# EAGLE design ASURA7200 (EAGLE 9.6.2)
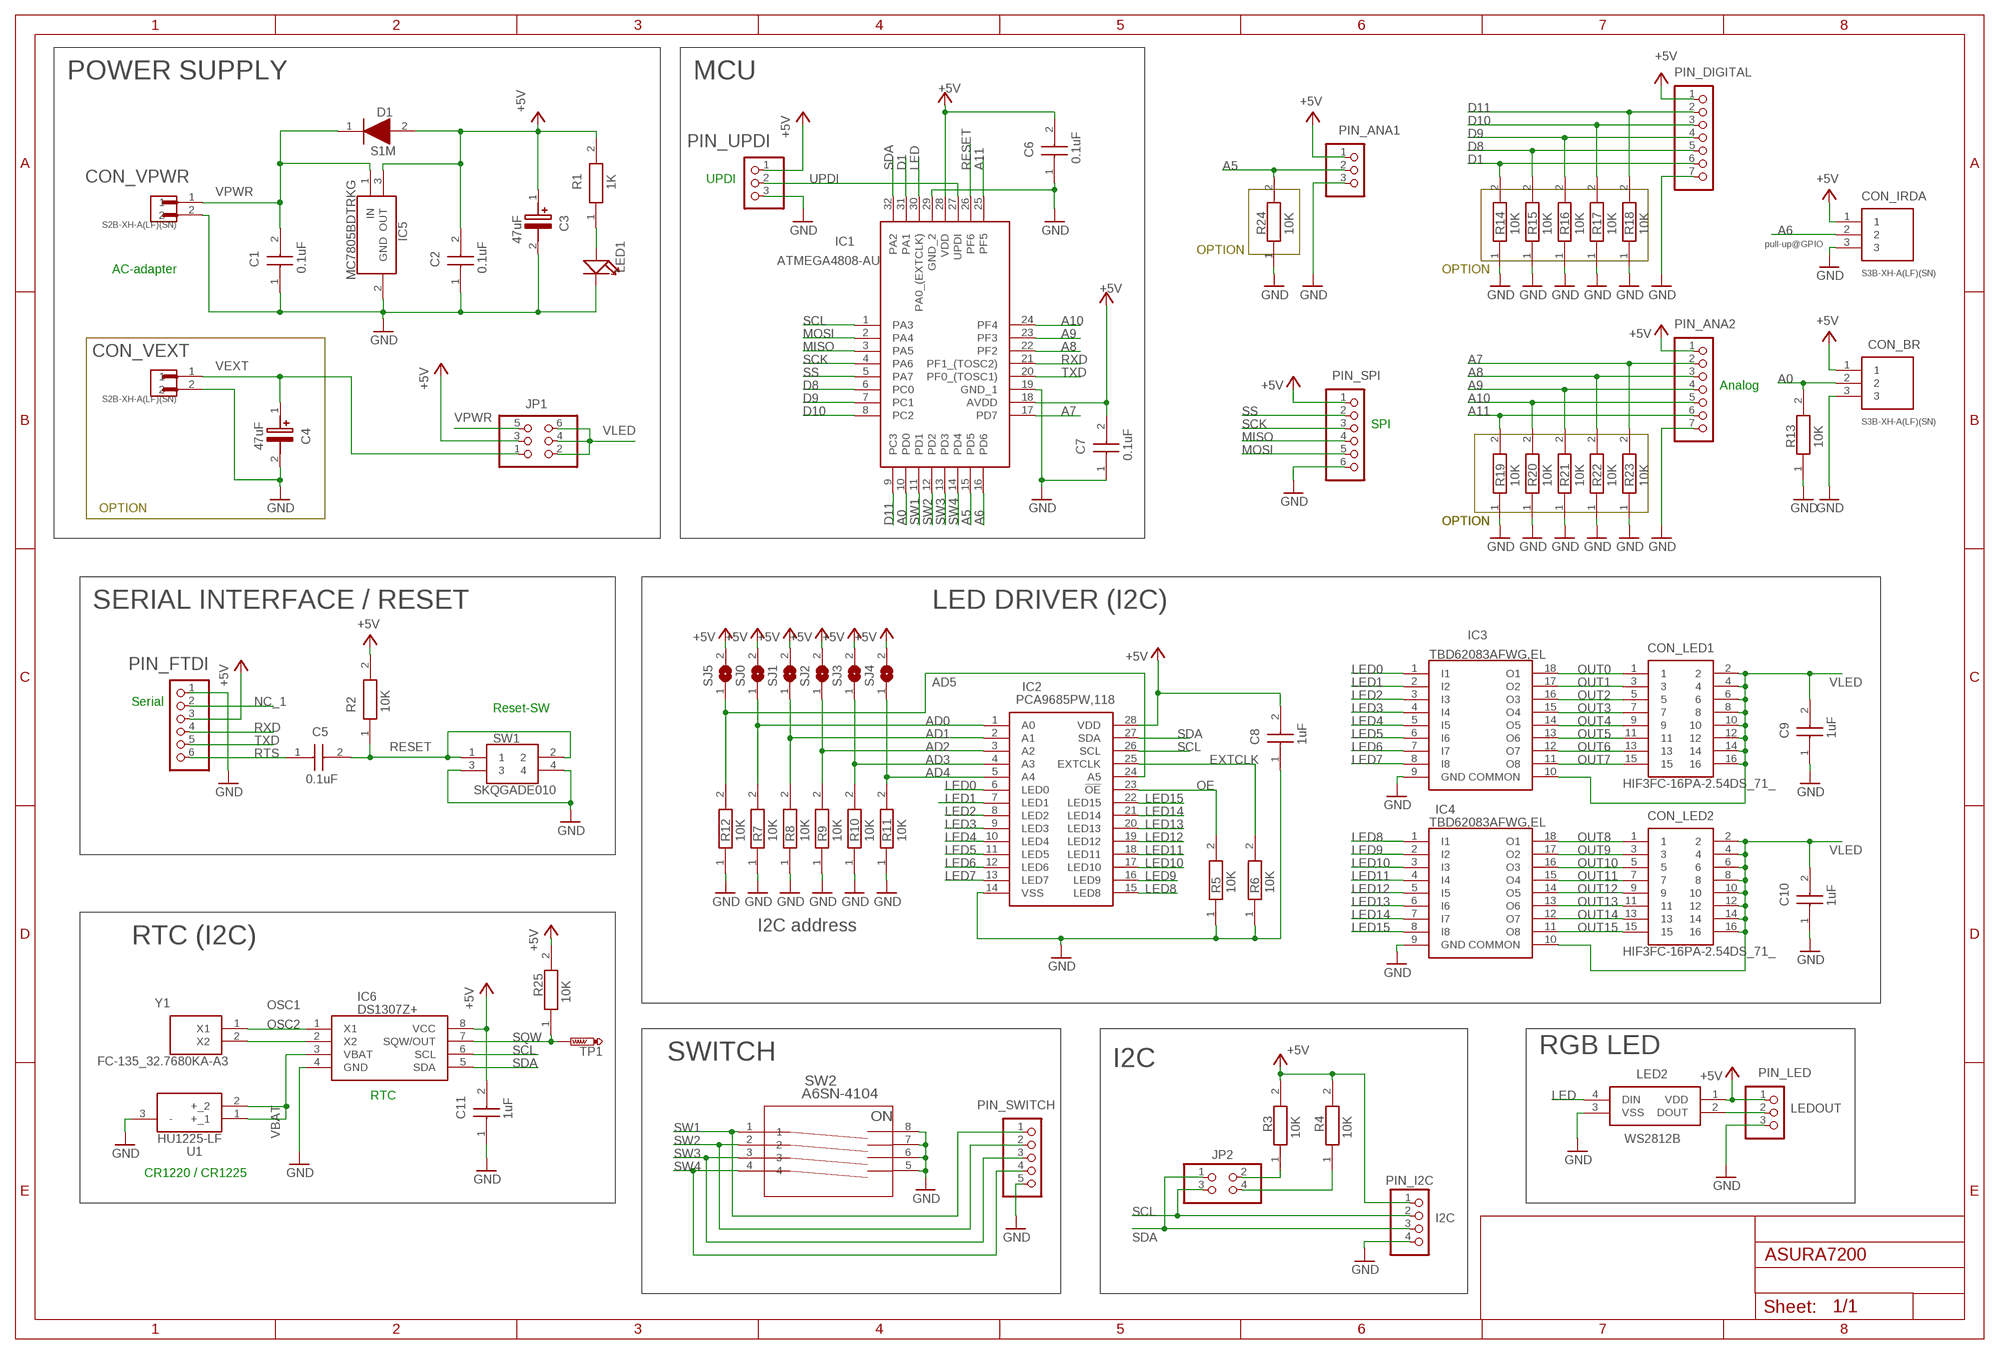
[diagram p0: schematic, sheet 1]

## Parts
C1  CC0603KRX7R9BB104  [CAPC1608X90N]
C2  CC0603KRX7R8BB105  [CAPC1608X90N]
C3  UUD1H470MCL1GS  [CAPAE660X800N]
C4  UUD1H470MCL1GS  [CAPAE660X800N]
C5  CC0603KRX7R8BB105  [CAPC1608X90N]
C6  CC0603KRX7R8BB105  [CAPC1608X90N]
C7  CC0603KRX7R8BB105  [CAPC1608X90N]
C8  CC0603KRX7R9BB104  [CAPC1608X90N]
C9  CC0603KRX7R9BB104  [CAPC1608X90N]
C10  CC0603KRX7R9BB104  [CAPC1608X90N]
C11  CC0603KRX7R8BB105  [CAPC1608X90N]
CON_BR  S3B-XH-A(LF)(SN)  [JST_S3B-XH-A(LF)(SN)]
CON_IRDA  S3B-XH-A(LF)(SN)  [JST_S3B-XH-A(LF)(SN)]
CON_LED1  HIF3FC-16PA-2.54DS_71_  [SHDRRA16W69P254X254_2X8_2782X8]
CON_LED2  HIF3FC-16PA-2.54DS_71_  [SHDRRA16W69P254X254_2X8_2782X8]
CON_VEXT  S2B-XH-A(LF)(SN)  [JST_S2B-XH-A(LF)(SN)]
CON_VPWR  S2B-XH-A(LF)(SN)  [JST_S2B-XH-A(LF)(SN)]
D1  S1M  [DIOM5227X270N]
IC1  ATMEGA4808-AU  [QFP80P900X900X120-32N]
IC2  PCA9685PW,118  [SOP65P640X110-28N]
IC3  TBD62083AFWG,EL  [SOIC127P1032X285-18N]
IC4  TBD62083AFWG,EL  [SOIC127P1032X285-18N]
IC5  MC7805BDTRKG  [LM317MADTRKG]
IC6  DS1307Z+  [SOIC127P600X175-8N]
JP1  PINHD-2X3  [2X03]
JP2  PINHD-2X2  [2X02]
LED1  SMD-LED-CLEAR-GREEN(0603)  [LED-0603]
LED2  WS2812B  [WS2812B]
PIN_ANA1  PINHD-1X3  [1X03]
PIN_ANA2  PINHD-1X7  [1X07]
PIN_DIGITAL  PINHD-1X7  [1X07]
PIN_FTDI  PINHD-1X6/90  [1X06/90]
PIN_I2C  PINHD-1X4  [1X04]
PIN_LED  PINHD-1X3  [1X03]
PIN_SPI  PINHD-1X6  [1X06]
PIN_SWITCH  PINHD-1X5  [1X05]
PIN_UPDI  PINHD-1X3  [1X03]
R1  RC0603JR-071KL  [RESC1608X55N]
R2  RC0603JR-0710KL  [RESC1608X55N]
R3  RC0603JR-0710KL  [RESC1608X55N]
R4  RC0603JR-0710KL  [RESC1608X55N]
R5  RC0603JR-0710KL  [RESC1608X55N]
R6  RC0603JR-0710KL  [RESC1608X55N]
R7  RC0603JR-0710KL  [RESC1608X55N]
R8  RC0603JR-0710KL  [RESC1608X55N]
R9  RC0603JR-0710KL  [RESC1608X55N]
R10  RC0603JR-0710KL  [RESC1608X55N]
R11  RC0603JR-0710KL  [RESC1608X55N]
R12  RC0603JR-0710KL  [RESC1608X55N]
R13  RC0603JR-0710KL  [RESC1608X55N]
R14  RC0603JR-0710KL  [RESC1608X55N]
R15  RC0603JR-0710KL  [RESC1608X55N]
R16  RC0603JR-0710KL  [RESC1608X55N]
R17  RC0603JR-0710KL  [RESC1608X55N]
R18  RC0603JR-0710KL  [RESC1608X55N]
R19  RC0603JR-0710KL  [RESC1608X55N]
R20  RC0603JR-0710KL  [RESC1608X55N]
R21  RC0603JR-0710KL  [RESC1608X55N]
R22  RC0603JR-0710KL  [RESC1608X55N]
R23  RC0603JR-0710KL  [RESC1608X55N]
R24  RC0603JR-0710KL  [RESC1608X55N]
R25  RC0603JR-0710KL  [RESC1608X55N]
SJ0  SJ  [SJ]
SJ1  SJ  [SJ]
SJ2  SJ  [SJ]
SJ3  SJ  [SJ]
SJ4  SJ  [SJ]
SJ5  SJ  [SJ]
SW1  SKQGADE010  [SKQGAKE010]
SW2  A6SN-4104  [SW_A6SN-4104_OMR]
TP1  PTR1PAD1-13  [P1-13]
U1  HU1225-LF  [HU1225LF]
Y1  FC-135_32.7680KA-A3  [FC135327680KAA3]

## Nets
+5V [Power]: C2.2 C3.1(+) C6.2 C7.2 C8.2 C11.2 CON_BR.1 CON_IRDA.1 D1.2(A) IC1.18(AVDD) IC1.28(VDD) IC2.28(VDD) IC5.3(OUT) IC6.8(VCC) JP1.3 LED2.1(VDD) PIN_ANA1.1 PIN_ANA2.1 PIN_DIGITAL.1 PIN_FTDI.3 PIN_I2C.1 PIN_LED.1 PIN_SPI.1 PIN_UPDI.1 R1.2 R2.2 R3.2 R4.2 R25.2 SJ0.2 SJ1.2 SJ2.2 SJ3.2 SJ4.2 SJ5.2
A0: CON_BR.2 IC1.10(PD0) R13.2
A5: IC1.15(PD5) PIN_ANA1.2 R24.2
A6: CON_IRDA.2 IC1.16(PD6)
A7: IC1.17(PD7) PIN_ANA2.2 R23.2
A8: IC1.22(PF2) PIN_ANA2.3 R22.2
A9: IC1.23(PF3) PIN_ANA2.4 R21.2
A10: IC1.24(PF4) PIN_ANA2.5 R20.2
A11: IC1.25(PF5) PIN_ANA2.6 R19.2
AD0: IC2.1(A0) R7.2 SJ0.1
AD1: IC2.2(A1) R8.2 SJ1.1
AD2: IC2.3(A2) R9.2 SJ2.1
AD3: IC2.4(A3) R10.2 SJ3.1
AD4: IC2.5(A4) R11.2 SJ4.1
AD5: IC2.24(A5) R12.2 SJ5.1
D1: IC1.31(PA1) PIN_DIGITAL.6 R14.2
D8: IC1.6(PC0) PIN_DIGITAL.5 R15.2
D9: IC1.7(PC1) PIN_DIGITAL.4 R16.2
D10: IC1.8(PC2) PIN_DIGITAL.3 R17.2
D11: IC1.9(PC3) PIN_DIGITAL.2 R18.2
EXTCLK: IC2.25(EXTCLK) R6.2
GND [Ground]: C1.1 C2.1 C3.2(-) C4.2(-) C6.1 C7.1 C8.1 C9.1 C10.1 C11.1 CON_BR.3 CON_IRDA.3 CON_VEXT.2 CON_VPWR.2 IC1.19(GND_1) IC1.29(GND_2) IC2.14(VSS) IC3.9(GND) IC4.9(GND) IC5.2(GND) IC6.4(GND) LED1.- LED2.3(VSS) PIN_ANA1.3 PIN_ANA2.7 PIN_DIGITAL.7 PIN_FTDI.1 PIN_I2C.4 PIN_LED.3 PIN_SPI.6 PIN_SWITCH.5 PIN_UPDI.3 R5.1 R6.1 R7.1 R8.1 R9.1 R10.1 R11.1 R12.1 R13.1 R14.1 R15.1 R16.1 R17.1 R18.1 R19.1 R20.1 R21.1 R22.1 R23.1 R24.1 SW1.3 SW1.4 SW2.5 SW2.6 SW2.7 SW2.8 U1.3(-)
LED: IC1.30(PA0_(EXTCLK)) LED2.4(DIN)
LED0 [LED_drive]: IC2.6(LED0) IC3.1(I1)
LED1 [LED_drive]: IC2.7(LED1) IC3.2(I2)
LED2 [LED_drive]: IC2.8(LED2) IC3.3(I3)
LED3 [LED_drive]: IC2.9(LED3) IC3.4(I4)
LED4 [LED_drive]: IC2.10(LED4) IC3.5(I5)
LED5 [LED_drive]: IC2.11(LED5) IC3.6(I6)
LED6 [LED_drive]: IC2.12(LED6) IC3.7(I7)
LED7 [LED_drive]: IC2.13(LED7) IC3.8(I8)
LED8 [LED_drive]: IC2.15(LED8) IC4.1(I1)
LED9 [LED_drive]: IC2.16(LED9) IC4.2(I2)
LED10 [LED_drive]: IC2.17(LED10) IC4.3(I3)
LED11 [LED_drive]: IC2.18(LED11) IC4.4(I4)
LED12 [LED_drive]: IC2.19(LED12) IC4.5(I5)
LED13 [LED_drive]: IC2.20(LED13) IC4.6(I6)
LED14 [LED_drive]: IC2.21(LED14) IC4.7(I7)
LED15 [LED_drive]: IC2.22(LED15) IC4.8(I8)
LED_IN: LED1.+ R1.1
LEDOUT: LED2.2(DOUT) PIN_LED.2
MISO: IC1.3(PA5) PIN_SPI.4
MOSI: IC1.2(PA4) PIN_SPI.5
NC_1: PIN_FTDI.2
OE: IC2.23(!OE) R5.2
OSC1: IC6.1(X1) Y1.1(X1)
OSC2: IC6.2(X2) Y1.2(X2)
OUT0: CON_LED1.1 IC3.18(O1)
OUT1: CON_LED1.3 IC3.17(O2)
OUT2: CON_LED1.5 IC3.16(O3)
OUT3: CON_LED1.7 IC3.15(O4)
OUT4: CON_LED1.9 IC3.14(O5)
OUT5: CON_LED1.11 IC3.13(O6)
OUT6: CON_LED1.13 IC3.12(O7)
OUT7: CON_LED1.15 IC3.11(O8)
OUT8: CON_LED2.1 IC4.18(O1)
OUT9: CON_LED2.3 IC4.17(O2)
OUT10: CON_LED2.5 IC4.16(O3)
OUT11: CON_LED2.7 IC4.15(O4)
OUT12: CON_LED2.9 IC4.14(O5)
OUT13: CON_LED2.11 IC4.13(O6)
OUT14: CON_LED2.13 IC4.12(O7)
OUT15: CON_LED2.15 IC4.11(O8)
RESET: C5.2 IC1.26(PF6) R2.1 SW1.1 SW1.2
RTS: C5.1 PIN_FTDI.6
RXD: IC1.21(PF1_(TOSC2)) PIN_FTDI.4
SCK: IC1.4(PA6) PIN_SPI.3
SCL: IC1.1(PA3) IC2.26(SCL) IC6.6(SCL) JP2.3 PIN_I2C.2
SCL_1: JP2.4 R4.1
SDA: IC1.32(PA2) IC2.27(SDA) IC6.5(SDA) JP2.1 PIN_I2C.3
SDA_1: JP2.2 R3.1
SQW: IC6.7(SQW/OUT) R25.1 TP1.TP
SS: IC1.5(PA7) PIN_SPI.2
SW1: IC1.11(PD1) PIN_SWITCH.1 SW2.1
SW2: IC1.12(PD2) PIN_SWITCH.2 SW2.2
SW3: IC1.13(PD3) PIN_SWITCH.3 SW2.3
SW4: IC1.14(PD4) PIN_SWITCH.4 SW2.4
TXD: IC1.20(PF0_(TOSC1)) PIN_FTDI.5
UPDI: IC1.27(UPDI) PIN_UPDI.2
VBAT [Power]: IC6.3(VBAT) U1.1(+_1) U1.2(+_2)
VEXT: C4.1(+) CON_VEXT.1 JP1.1
VLED [Power]: C9.2 C10.2 CON_LED1.2 CON_LED1.4 CON_LED1.6 CON_LED1.8 CON_LED1.10 CON_LED1.12 CON_LED1.14 CON_LED1.16 CON_LED2.2 CON_LED2.4 CON_LED2.6 CON_LED2.8 CON_LED2.10 CON_LED2.12 CON_LED2.14 CON_LED2.16 IC3.10(COMMON) IC4.10(COMMON) JP1.2 JP1.4 JP1.6
VPWR [Power]: C1.2 CON_VPWR.1 D1.1(K) IC5.1(IN) JP1.5

## Notes on the sheet
- POWER SUPPLY | MCU
- UPDI
- pull-up@GPIO
- OPTION
- AC-adapter | OPTION
- Analog
- SPI
- OPTION
- OPTION | OPTION
- SERIAL INTERFACE / RESET | LED DRIVER (I2C)
- Serial
- Reset-SW
- I2C address
- RTC (I2C)
- SWITCH | RGB LED
- I2C
- RTC
- CR1220 / CR1225
- I2C

## Library data of the parts
C1 = CC0603KRX7R9BB104:CC0603KRX7R9BB104: CAPACITOR, 0603 100nF +/-10% 50V Source: Datasheet <http://componentsearchengine.com/Datasheets/3/CC0603KRX7R9BB104.pdf>; C: 0.1uF; DESCRIPTION: CAPACITOR, 0603 100nF +/-10% 50V; HEIGHT: 0.9mm; MANUFACTURER_NAME: YAGEO (PHYCOMP); MANUFACTURER_PART_NUMBER: CC0603KRX7R9BB104; MOUSER_PART_NUMBER: 603-CC603KRX7R9BB104; MOUSER_PRICE-STOCK: https://www.mouser.co.uk/ProductDetail/YAGEO/CC0603KRX7R9BB104?qs=vTakOoo5QyLvVCYM2ge8LQ%3D%3D
C2 C5-C7 = ASURA7200:CC0603KRX7R8BB105: Cap Ceramic 1uF 25V X7R 10% Pad SMD 0603 125C T/R Source: Datasheet <https://www.yageo.com/upload/media/product/productsearch/datasheet/mlcc/UPY-GPHC_X7R_6.3V-to-50V_18.pdf>; C: 0.1uF; DESCRIPTION: Cap Ceramic 1uF 25V X7R 10% Pad SMD 0603 125C T/R; HEIGHT: 0.9mm; MANUFACTURER_NAME: YAGEO (PHYCOMP); MANUFACTURER_PART_NUMBER: CC0603KRX7R8BB105; MOUSER_PART_NUMBER: 603-CC603KRX7R8BB105; MOUSER_PRICE-STOCK: https://www.mouser.co.uk/ProductDetail/YAGEO/CC0603KRX7R8BB105?qs=57cj7OiSijm1JqG%252BGXtOuQ%3D%3D
C3 C4 = ASURA7200:UUD1H470MCL1GS: Aluminum Electrolytic Capacitors - SMD 50volts 47uF AEC-Q200 Source: Datasheet <http://uk.rs-online.com/web/p/products/1677902>; C: 47uF; DESCRIPTION: Aluminum Electrolytic Capacitors - SMD 50volts 47uF AEC-Q200; HEIGHT: 8mm; MANUFACTURER_NAME: Nichicon; MANUFACTURER_PART_NUMBER: UUD1H470MCL1GS; RS_PART_NUMBER: 1677902; RS_PRICE-STOCK: http://uk.rs-online.com/web/p/products/1677902
C8-C10 = ASURA7200:CC0603KRX7R9BB104: CAPACITOR, 0603 100nF +/-10% 50V Source: Datasheet <http://componentsearchengine.com/Datasheets/3/CC0603KRX7R9BB104.pdf>; C: 1uF; DESCRIPTION: CAPACITOR, 0603 100nF +/-10% 50V; HEIGHT: 0.9mm; MANUFACTURER_NAME: YAGEO (PHYCOMP); MANUFACTURER_PART_NUMBER: CC0603KRX7R9BB104; MOUSER_PART_NUMBER: 603-CC603KRX7R9BB104; MOUSER_PRICE-STOCK: https://www.mouser.co.uk/ProductDetail/YAGEO/CC0603KRX7R9BB104?qs=vTakOoo5QyLvVCYM2ge8LQ%3D%3D
C11 = ASURA7200:CC0603KRX7R8BB105: Cap Ceramic 1uF 25V X7R 10% Pad SMD 0603 125C T/R Source: Datasheet <https://www.yageo.com/upload/media/product/productsearch/datasheet/mlcc/UPY-GPHC_X7R_6.3V-to-50V_18.pdf>; C: 1uF; DESCRIPTION: Cap Ceramic 1uF 25V X7R 10% Pad SMD 0603 125C T/R; HEIGHT: 0.9mm; MANUFACTURER_NAME: YAGEO (PHYCOMP); MANUFACTURER_PART_NUMBER: CC0603KRX7R8BB105; MOUSER_PART_NUMBER: 603-CC603KRX7R8BB105; MOUSER_PRICE-STOCK: https://www.mouser.co.uk/ProductDetail/YAGEO/CC0603KRX7R8BB105?qs=57cj7OiSijm1JqG%252BGXtOuQ%3D%3D
CON_BR CON_IRDA = S3B-XH-A_LF__SN_:S3B-XH-A(LF)(SN): Connector Header Through Hole, Right Angle 3 position 0.098" (2.50mm); DESCRIPTION: Connector Header Through Hole, Right Angle 3 position 0.098 (2.50mm); DIGI-KEY_PART_NUMBER: 455-2250-ND; MF: JST Sales; MP: S3B-XH-A(LF)(SN); PACKAGE: Custom Package JST Sales
CON_LED1 CON_LED2 = HIF3FC-16PA-2.54DS_71_:HIF3FC-16PA-2.54DS_71_: Headers & Wire Housings 16P R/A PIN HEADER LOW PROF CON GLD PLT Source: Datasheet <https://www.hirose.com/en/product/document?clcode=CL0616-0063-5-71&productname=HIF3FC-16PA-2.54DS(71)&series=HIF3FC&documenttype=2DDrawing&lang=en&documentid=0000989434>; DESCRIPTION: Headers & Wire Housings 16P R/A PIN HEADER LOW PROF CON GLD PLT; HEIGHT: 8.8mm; MANUFACTURER_NAME: Hirose; MANUFACTURER_PART_NUMBER: HIF3FC-16PA-2.54DS(71); MOUSER_PART_NUMBER: 798-HIF3FC16PA254DS1; MOUSER_PRICE-STOCK: https://www.mouser.co.uk/ProductDetail/Hirose-Connector/HIF3FC-16PA-254DS71?qs=eDUdFcBPps3jyvgX0QUBjw%3D%3D
CON_VEXT CON_VPWR = S2B-XH-A_LF__SN_:S2B-XH-A(LF)(SN): XH Series 2.5mm 2 Position Through Hole Shrouded Header Connector Check prices <https://pricing.snapeda.com/parts/S2B-XH-A%28LF%29%28SN%29/JST%20Sales/view-part?ref=eda>; AVAILABILITY: Warning; DESCRIPTION: Connector Header Through Hole, Right Angle 2 position 0.098 (2.50mm); MF: JST Sales; MP: S2B-XH-A(LF)(SN); PACKAGE: None; PRICE: None; PURCHASE-URL: https://pricing.snapeda.com/search/part/S2B-XH-A(LF)(SN)/?ref=eda
D1 = S1M:S1M: ON SEMICONDUCTOR - S1M - DIODE, STANDARD, 1A, 1000V, SMD Source: Datasheet <https://componentsearchengine.com/Datasheets/2/S1M.pdf>; ALLIED_NUMBER: 70098468; DESCRIPTION: ON SEMICONDUCTOR - S1M - DIODE, STANDARD, 1A, 1000V, SMD; HEIGHT: 2.7mm; MANUFACTURER_NAME: ON Semiconductor; MANUFACTURER_PART_NUMBER: S1M; RS_PART_NUMBER: 6708836; RS_PRICE-STOCK: https://uk.rs-online.com/web/p/products/6708836
IC1 = ATMEGA4808-AU:ATMEGA4808-AU: 8-bit Microcontrollers - MCU 20MHz, 48KB, TQFP Source: Datasheet; DESCRIPTION: 8-bit Microcontrollers - MCU 20MHz, 48KB, TQFP; HEIGHT: 1.2mm; MANUFACTURER_NAME: Microchip; MANUFACTURER_PART_NUMBER: ATMEGA4808-AU; MOUSER_PART_NUMBER: 556-ATMEGA4808-AU; MOUSER_PRICE-STOCK: https://www.mouser.co.uk/ProductDetail/Microchip-Technology-Atmel/ATMEGA4808-AU?qs=P1JMDcb91o4OSr3c6aXxLg%3D%3D
IC2 = ASURA7200:PCA9685PW,118: LED Display Drivers Source: Datasheet <http://www.nxp.com/docs/en/data-sheet/PCA9685.pdf>; DESCRIPTION: LED Display Drivers; HEIGHT: 1.1mm; MANUFACTURER_NAME: NXP; MANUFACTURER_PART_NUMBER: PCA9685PW,118; MOUSER_PART_NUMBER: 771-PCA9685PW,118; MOUSER_PRICE-STOCK: https://www.mouser.co.uk/ProductDetail/NXP-Semiconductors/PCA9685PW118?qs=6YAT8rHPFU%252BtfwwKq4nwEQ%3D%3D
IC3 IC4 = TBD62083AFWG_EL:TBD62083AFWG,EL: Gate Drivers DMOS Transistor Array 8-CH, 50V/0.5A Source: Datasheet; DESCRIPTION: Gate Drivers DMOS Transistor Array 8-CH, 50V/0.5A; HEIGHT: 2.85mm; MANUFACTURER_NAME: Toshiba; MANUFACTURER_PART_NUMBER: TBD62083AFWG,EL; MOUSER_PART_NUMBER: 757-TBD62083AFWGEL; MOUSER_PRICE-STOCK: https://www.mouser.co.uk/ProductDetail/Toshiba/TBD62083AFWGEL?qs=fSnNYG2PaKJPpDBB6xK1QA%3D%3D
IC5 = MC7805BDTRKG:MC7805BDTRKG: Linear Voltage Regulators 5V 1A Positive Source: Datasheet <https://componentsearchengine.com/Datasheets/2/MC7805BDTRKG.pdf>; DESCRIPTION: Linear Voltage Regulators 5V 1A Positive; HEIGHT: 2.38mm; MANUFACTURER_NAME: ON Semiconductor; MANUFACTURER_PART_NUMBER: MC7805BDTRKG; MOUSER_PART_NUMBER: 863-MC7805BDTRKG; MOUSER_PRICE-STOCK: https://www.mouser.co.uk/ProductDetail/ON-Semiconductor/MC7805BDTRKG?qs=%252B9%2Fcbd0IE0RVSCV5SBH6%2FA%3D%3D
IC6 = DS1307Z+:DS1307Z+: DS1307Z+, Real Time Clock, Alarm, Calendar, Clock, 56B RAM, I2C, 5V, 8-Pin SOIC Source: Datasheet <http://datasheets.maximintegrated.com/en/ds/DS1307.pdf>; DESCRIPTION: DS1307Z+, Real Time Clock, Alarm, Calendar, Clock, 56B RAM, I2C, 5V, 8-Pin SOIC; HEIGHT: 1.75mm; MANUFACTURER_NAME: Maxim Integrated; MANUFACTURER_PART_NUMBER: DS1307Z+; MOUSER_PART_NUMBER: 700-DS1307Z; MOUSER_PRICE-STOCK: https://www.mouser.co.uk/ProductDetail/Maxim-Integrated/DS1307Z%2b?qs=0Y9aZN%252BMVCUvNDMAh9aCtw%3D%3D
JP1 = ASURA7200:PINHD-2X3: PIN HEADER
JP2 = pinhead:PINHD-2X2: PIN HEADER
LED1 = SMD-LED-CLEAR-GREEN_0603_:SMD-LED-CLEAR-GREEN(0603): 304090043 Check prices <https://pricing.snapeda.com/parts/19-217/G7C-AN1P2/3T/Everlight/view-part?ref=eda>; AVAILABILITY: Not in stock; DESCRIPTION: 0603 Package Chip LED; MF: Everlight; MP: 19-217/G7C-AN1P2/3T; PACKAGE: 0603 Everlight; PRICE: None
LED2 = WS2812B:WS2812B: Intelligent control LED integrated light source Source: Datasheet <https://www.adafruit.com/datasheets/WS2812B.pdf>; DESCRIPTION: Intelligent control LED integrated light source; HEIGHT: mm; MANUFACTURER_NAME: Worldsemi; MANUFACTURER_PART_NUMBER: WS2812B
PIN_ANA1 PIN_LED PIN_UPDI = pinhead:PINHD-1X3: PIN HEADER
PIN_ANA2 PIN_DIGITAL = pinhead:PINHD-1X7: PIN HEADER
PIN_FTDI PIN_SPI = pinhead:PINHD-1X6: PIN HEADER
PIN_I2C = pinhead:PINHD-1X4: PIN HEADER
PIN_SWITCH = pinhead:PINHD-1X5: PIN HEADER
R1 = RC0603JR-071KL:RC0603JR-071KL: YAGEO (PHYCOMP) - RC0603JR-071KL - RES, THICK FILM, 1K, 5%, 0.1W, 0603 Source: Datasheet <http://www.yageo.com/documents/recent/PYu-RC0603_51_RoHS_L_v5.pdf>; DESCRIPTION: YAGEO (PHYCOMP) - RC0603JR-071KL - RES, THICK FILM, 1K, 5%, 0.1W, 0603; HEIGHT: 0.55mm; MANUFACTURER_NAME: YAGEO (PHYCOMP); MANUFACTURER_PART_NUMBER: RC0603JR-071KL; MOUSER_PART_NUMBER: 603-RC0603JR-071KL; MOUSER_PRICE-STOCK: https://www.mouser.co.uk/ProductDetail/YAGEO/RC0603JR-071KL?qs=%2F9ZTgpVJnN7bctK4R%2FDEoA%3D%3D; R: 1K
R2-R25 = RC0603JR-0710KL:RC0603JR-0710KL: YAGEO (PHYCOMP) - RC0603JR-0710KL - RES, THICK FILM, 10K, 5%, 0.1W, 0603 Source: Datasheet <http://www.yageo.com/documents/recent/PYu-RC0603_51_RoHS_L_v5.pdf>; DESCRIPTION: YAGEO (PHYCOMP) - RC0603JR-0710KL - RES, THICK FILM, 10K, 5%, 0.1W, 0603; HEIGHT: 0.55mm; MANUFACTURER_NAME: YAGEO (PHYCOMP); MANUFACTURER_PART_NUMBER: RC0603JR-0710KL; MOUSER_PART_NUMBER: 603-RC0603JR-0710KL; MOUSER_PRICE-STOCK: https://www.mouser.co.uk/ProductDetail/YAGEO/RC0603JR-0710KL?qs=ksOUTF%2FWcd8D6T22BJkQ7g%3D%3D; R: 10K
SJ0 SJ1-SJ5 = jumper:SJ: SMD solder JUMPER
SW1 = SKQGADE010:SKQGADE010: Tact switch,SMT,SPST,with stem,2.55N o/f Stem Tactile Switch, SPST-NO 50 mA 1.5mm Source: Datasheet; DESCRIPTION: Tact switch,SMT,SPST,with stem,2.55N o/f Stem Tactile Switch, SPST-NO 50 mA 1.5mm; HEIGHT: mm; MANUFACTURER_NAME: ALPS; MANUFACTURER_PART_NUMBER: SKQGADE010; MOUSER_PART_NUMBER: 688-SKQGAD; MOUSER_PRICE-STOCK: https://www.mouser.co.uk/ProductDetail/ALPS/SKQGADE010?qs=N5Jky1br14PCAY42dbciFw%3D%3D
SW2 = ASURA7200:A6SN-4104; BUILT_BY: EMA_Kyle; COPYRIGHT: Copyright (C) 2018 Accelerated Designs. All rights reserved; MANUFACTURER_PART_NUMBER: A6SN-4104; SOURCELIBRARY: Omron_2019-09-26; VENDOR: Omron
TP1 = testpad:PTR1: TEST PIN
U1 = HU1225-LF:HU1225-LF: Coin Cell Battery Holders THRU HOLE FOR CR1225 Source: Datasheet; DESCRIPTION: Coin Cell Battery Holders THRU HOLE FOR CR1225; HEIGHT: 4.5mm; MANUFACTURER_NAME: RENATA; MANUFACTURER_PART_NUMBER: HU1225-LF; MOUSER_PART_NUMBER: 614-HU1225-LF; MOUSER_PRICE-STOCK: https://www.mouser.co.uk/ProductDetail/Renata/HU1225-LF?qs=VBDIa651eQFgeJRaxFmjFw%3D%3D
Y1 = FC-135_32.7680KA-A3:FC-135_32.7680KA-A3: Crystals 32.768KHz 20ppm 12.5pF -40C -85C Source: Datasheet <https://support.epson.biz/td/api/doc_check.php?dl=brief_fc-135r_en.pdf>; DESCRIPTION: Crystals 32.768KHz 20ppm 12.5pF -40C -85C; HEIGHT: 0.9mm; MANUFACTURER_NAME: Epson Timing; MANUFACTURER_PART_NUMBER: FC-135 32.7680KA-A3; MOUSER_PART_NUMBER: 732-FC135-32.76KAA3; MOUSER_PRICE-STOCK: https://www.mouser.co.uk/ProductDetail/Epson-Timing/FC-135-327680KA-A3?qs=l3LL3yk8ONaUpektQ%252BySkw%3D%3D

## Net classes
0 default: width 0.203 mm, clearance 0.152 mm
1 LED_drive: width 0.203 mm, clearance 0.152 mm to class 0, clearance 0.152 mm
2 Power: width 0.406 mm, clearance 0.152 mm to class 0, clearance 0.152 mm to class 1, clearance 0.152 mm
3 Ground: width 0.406 mm, clearance 0.152 mm to class 0, clearance 0.152 mm to class 1, clearance 0.152 mm to class 2, clearance 0.152 mm

## Board
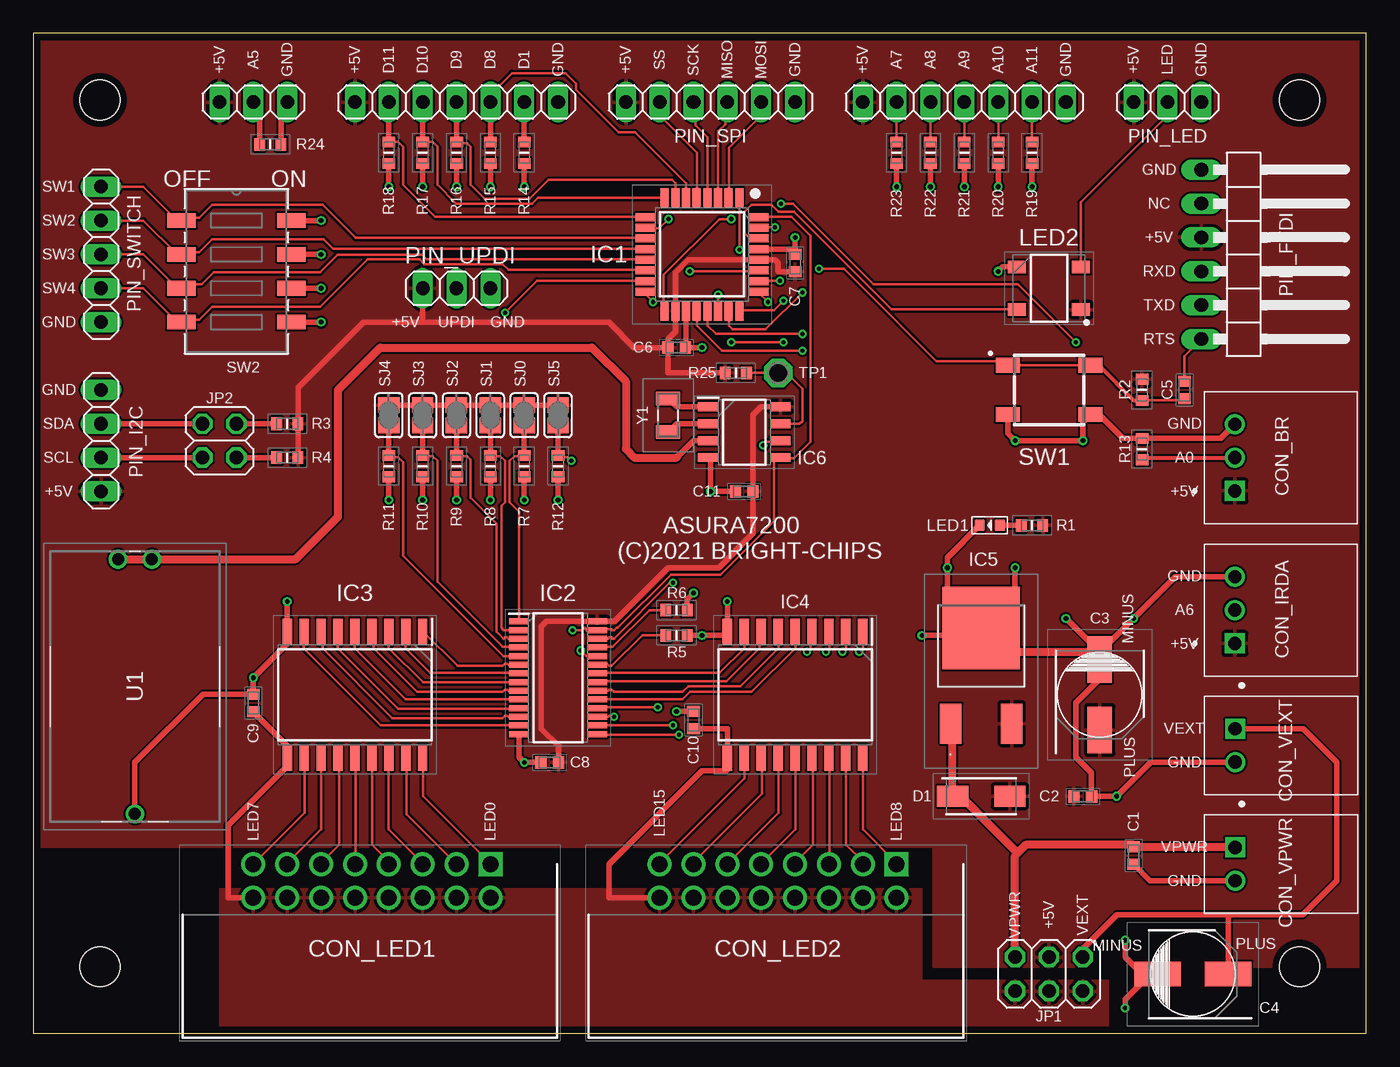
[diagram p1: board, top side]
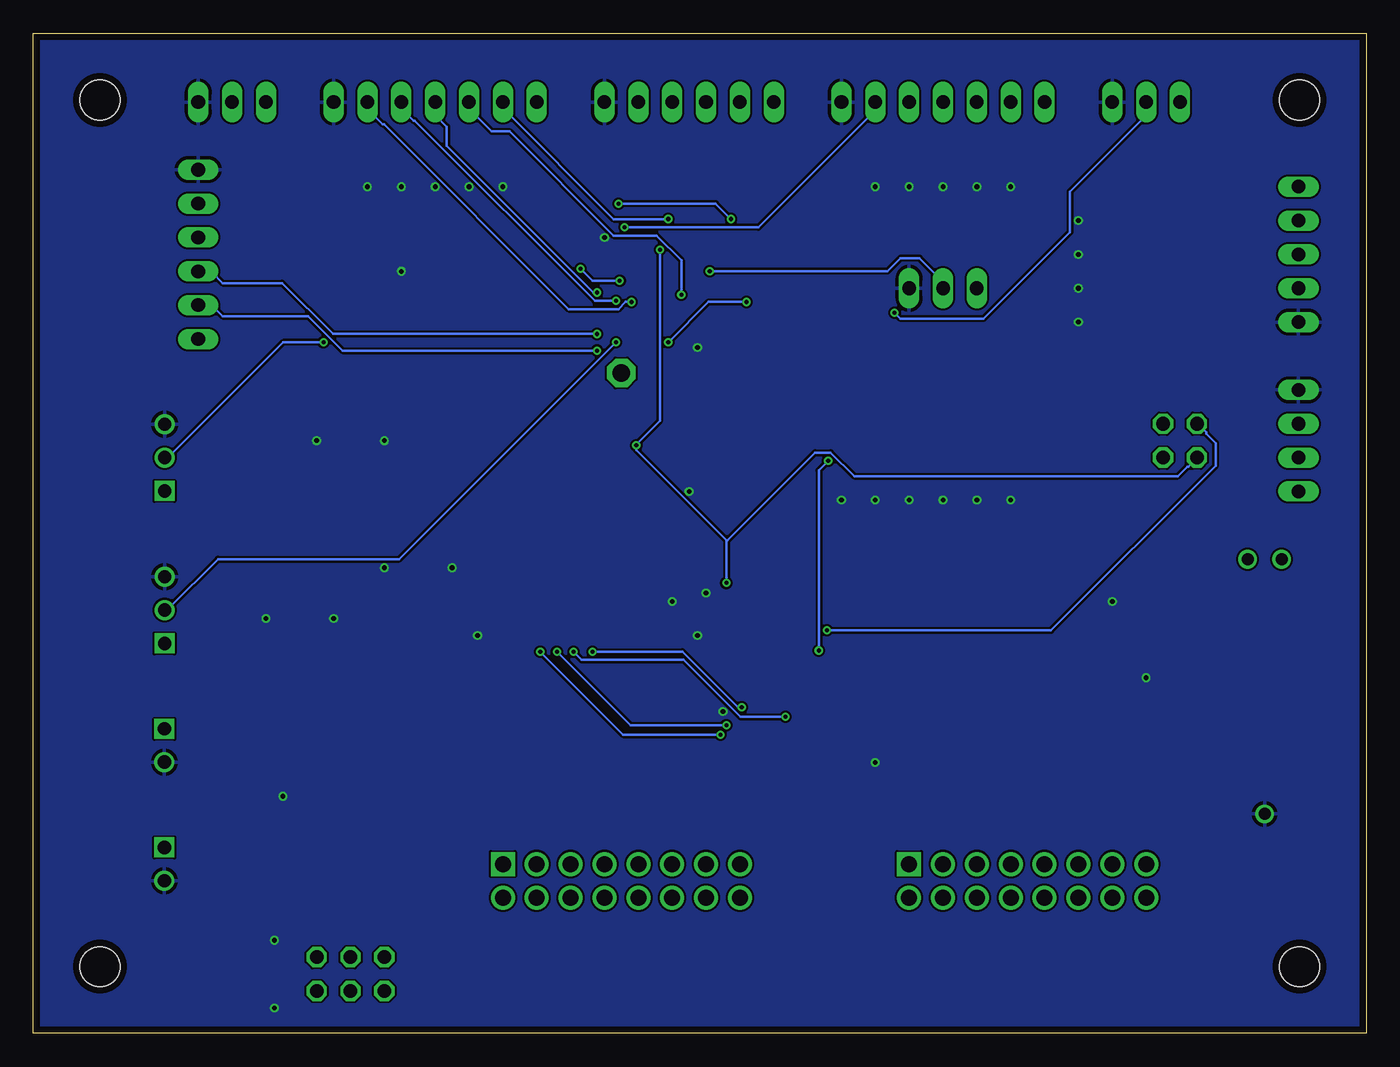
[diagram p2: board, bottom side, seen from below]

Size 100 x 75 mm. Coordinates in mm from the lower left corner, seen from the top.
Outline: 0,0 100,0 100,75 0,75 0,0
Copper layers (1*16): Top 0.035mm / dielectric 1.6mm / Bottom 0.035mm
Design rules "Elecrow_2-layer_PCB_eagle_rule": minimum track width 6mil, minimum drill 12mil, track to track 6mil, track to pad 6mil, pad to pad 6mil, via to via 8mil, smd to smd 0mil, copper to edge 20mil, drill to drill 10mil, minimum pad ring 6mil, minimum via ring 6mil, stop-mask expansion 0mil, vias tented up to drill 100mil, thermal gap 10mil
Holes 3 mm at 5,70 95,70 95,5 5,5

### Footprints (pad centres in the part's own frame; a part is rotated, then mirrored left to right if it is on the bottom)
CAPC1608X90N = smd 0.83 x 0.94: 1 -0.66,0; 2 0.66,0
CAPAE660X800N = smd 3.5 x 1.85: 1 -2.65,0; 2 2.65,0
JST_S3B-XH-A(LF)(SN) = drill 1 square: 1 2.5,-3.45 | drill 1: 2 0,-3.45; 3 -2.5,-3.45
SHDRRA16W69P254X254_2X8_2782X8 = drill 1.2 pad 1.8 square: 1 0,0 | drill 1.2 pad 1.8: 2 0,2.54; 3 2.54,0; 4 2.54,2.54; 5 5.08,0; 6 5.08,2.54; 7 7.62,0; 8 7.62,2.54; 9 10.16,0; 10 10.16,2.54; 11 12.7,0; 12 12.7,2.54; 13 15.24,0; 14 15.24,2.54; 15 17.78,0; 16 17.78,2.54
JST_S2B-XH-A(LF)(SN) = drill 1 square: 1 -1.25,0 | drill 1: 2 1.25,0
DIOM5227X270N = smd 2.35 x 1.55: 1 -2.15,0; 2 2.15,0
QFP80P900X900X120-32N = smd 1.475 x 0.6: 1 -4.238,2.8; 2 -4.238,2; 3 -4.238,1.2; 4 -4.238,0.4; 5 -4.238,-0.4; 6 -4.238,-1.2; 7 -4.238,-2; 8 -4.238,-2.8; 17 4.238,-2.8; 18 4.238,-2; 19 4.238,-1.2; 20 4.238,-0.4; 21 4.238,0.4; 22 4.238,1.2; 23 4.238,2; 24 4.238,2.8 | smd 0.6 x 1.475: 9 -2.8,-4.238; 10 -2,-4.238; 11 -1.2,-4.238; 12 -0.4,-4.238; 13 0.4,-4.238; 14 1.2,-4.238; 15 2,-4.238; 16 2.8,-4.238; 25 2.8,4.238; 26 2,4.238; 27 1.2,4.238; 28 0.4,4.238; 29 -0.4,4.238; 30 -1.2,4.238; 31 -2,4.238; 32 -2.8,4.238
SOP65P640X110-28N = smd 1.475 x 0.45: 1 -2.938,4.225; 2 -2.938,3.575; 3 -2.938,2.925; 4 -2.938,2.275; 5 -2.938,1.625; 6 -2.938,0.975; 7 -2.938,0.325; 8 -2.938,-0.325; 9 -2.938,-0.975; 10 -2.938,-1.625; 11 -2.938,-2.275; 12 -2.938,-2.925; 13 -2.938,-3.575; 14 -2.938,-4.225; 15 2.938,-4.225; 16 2.938,-3.575; 17 2.938,-2.925; 18 2.938,-2.275; 19 2.938,-1.625; 20 2.938,-0.975; 21 2.938,-0.325; 22 2.938,0.325; 23 2.938,0.975; 24 2.938,1.625; 25 2.938,2.275; 26 2.938,2.925; 27 2.938,3.575; 28 2.938,4.225
SOIC127P1032X285-18N = smd 1.95 x 0.7: 1 -4.725,5.08; 2 -4.725,3.81; 3 -4.725,2.54; 4 -4.725,1.27; 5 -4.725,0; 6 -4.725,-1.27; 7 -4.725,-2.54; 8 -4.725,-3.81; 9 -4.725,-5.08; 10 4.725,-5.08; 11 4.725,-3.81; 12 4.725,-2.54; 13 4.725,-1.27; 14 4.725,0; 15 4.725,1.27; 16 4.725,2.54; 17 4.725,3.81; 18 4.725,5.08
LM317MADTRKG = smd 3 x 1.6: 1 4.08,-2.285; 3 4.08,2.285 | smd 6.2 x 5.8: 2 -3.1,0
SOIC127P600X175-8N = smd 1.525 x 0.65: 1 -2.712,1.905; 2 -2.712,0.635; 3 -2.712,-0.635; 4 -2.712,-1.905; 5 2.712,-1.905; 6 2.712,-0.635; 7 2.712,0.635; 8 2.712,1.905
2X03 = drill 1.016 octagon: 1 -2.54,-1.27; 2 -2.54,1.27; 3 0,-1.27; 4 0,1.27; 5 2.54,-1.27; 6 2.54,1.27
2X02 = drill 1.016 octagon: 1 -1.27,-1.27; 2 -1.27,1.27; 3 1.27,-1.27; 4 1.27,1.27
LED-0603 = smd 0.762 x 0.889: + -0.762,0; - 0.762,0
WS2812B = smd 1.35 x 0.95: 1 -2.4,1.6; 2 -2.4,-1.6; 3 2.4,-1.6; 4 2.4,1.6
1X03 = drill 1.016 long: 1 -2.54,0; 2 0,0; 3 2.54,0
1X07 = drill 1.016 long: 1 -7.62,0; 2 -5.08,0; 3 -2.54,0; 4 0,0; 5 2.54,0; 6 5.08,0; 7 7.62,0
1X06/90 = drill 1.016 long: 1 -6.35,-3.81; 2 -3.81,-3.81; 3 -1.27,-3.81; 4 1.27,-3.81; 5 3.81,-3.81; 6 6.35,-3.81
1X04 = drill 1.016 long: 1 -3.81,0; 2 -1.27,0; 3 1.27,0; 4 3.81,0
1X06 = drill 1.016 long: 1 -6.35,0; 2 -3.81,0; 3 -1.27,0; 4 1.27,0; 5 3.81,0; 6 6.35,0
1X05 = drill 1.016 long: 1 -5.08,0; 2 -2.54,0; 3 0,0; 4 2.54,0; 5 5.08,0
RESC1608X55N = smd 0.8 x 0.95: 1 -0.8,0; 2 0.8,0
SJ = smd 1.168 x 1.6: 1 -0.762,0; 2 0.762,0
SKQGAKE010 = smd 1.8 x 1.1: 1 -3.1,1.85; 2 3.1,1.85; 3 -3.1,-1.85; 4 3.1,-1.85
SW_A6SN-4104_OMR = smd 2.15 x 1.1: 1 -4.125,3.81; 2 -4.125,1.27; 3 -4.125,-1.27; 4 -4.125,-3.81; 5 4.125,-3.81; 6 4.125,-1.27; 7 4.125,1.27; 8 4.125,3.81
P1-13 = drill 1.321 pad 2.159 octagon: TP 0,0
HU1225LF = drill 0.9 pad 1.4: 1 0,0; 2 0,-2.54; 3 19.1,-1.27
FC135327680KAA3 = smd 1 x 1.8: 1 -1.25,0; 2 1.25,0

### Placement (x,y rotation side)
C1  82.55,13.34 90 top
C2  78.74,17.78 180 top
C3  80.01,25.4 90 top
C4  87,4.45 180 top
C5  86.36,48.26 270 top
C6  48.26,51.44 180 top
C7  57.15,57.78 270 top
C8  38.73,20.32 0 top
C9  16.51,24.77 270 top
C10  49.53,23.5 270 top
C11  53.34,40.64 0 top
CON_BR  93.6,43.18 270 top
CON_IRDA  93.6,31.75 270 top
CON_LED1  34.29,12.7 180 top
CON_LED2  64.77,12.7 180 top
CON_VEXT  90.17,21.59 270 top
CON_VPWR  90.17,12.7 270 top
D1  71.12,17.78 0 top
IC1  50.16,58.42 270 top
IC2  39.37,26.67 0 top
IC3  24.13,25.4 270 top
IC4  57.15,25.4 270 top
IC5  71.12,27.3 270 top
IC6  53.34,45.09 0 top
JP1  76.2,4.45 180 top
JP2  13.97,44.45 270 top
LED1  71.75,38.1 180 top
LED2  76.2,55.88 180 top
PIN_ANA1  16.51,69.85 0 top
PIN_ANA2  69.85,69.85 0 top
PIN_DIGITAL  31.75,69.85 0 top
PIN_FTDI  91.44,58.42 270 top
PIN_I2C  5.08,44.45 90 top
PIN_LED  85.09,69.85 0 top
PIN_SPI  50.8,69.85 0 top
PIN_SWITCH  5.08,58.42 270 top
PIN_UPDI  31.75,55.88 0 top
R1  74.93,38.1 0 top
R2  83.19,48.26 90 top
R3  19.05,45.72 0 top
R4  19.05,43.18 0 top
R5  48.26,29.84 180 top
R6  48.26,31.75 180 top
R7  36.83,42.55 90 top
R8  34.29,42.55 90 top
R9  31.75,42.55 90 top
R10  29.21,42.55 90 top
R11  26.67,42.55 90 top
R12  39.37,42.55 90 top
R13  83.19,43.81 270 top
R14  36.83,66.04 90 top
R15  34.29,66.04 90 top
R16  31.75,66.04 90 top
R17  29.21,66.04 90 top
R18  26.67,66.04 90 top
R19  74.93,66.04 90 top
R20  72.39,66.04 90 top
R21  69.85,66.04 90 top
R22  67.31,66.04 90 top
R23  64.77,66.04 90 top
R24  17.78,66.67 180 top
R25  52.7,49.53 180 top
SJ0  36.83,46.35 90 top
SJ1  34.29,46.35 90 top
SJ2  31.75,46.35 90 top
SJ3  29.21,46.35 90 top
SJ4  26.67,46.35 90 top
SJ5  39.37,46.35 90 top
SW1  76.2,48.26 0 top
SW2  15.24,57.15 0 top
TP1  55.88,49.53 0 top
U1  8.89,35.56 270 top
Y1  47.62,46.35 270 top

### Tracks (layer width: path | path; a pad name or v marks a point on that pad's centre or on a via)
+5V
  Top 0.406: C8.2 39.4,21.57 38.1,22.86 38.1,30.48 38.52,30.89 IC2.28 43.59,30.89 47.62,34.92 51.44,34.92 54,37.49 C11.2 54,46.38 54.61,46.99 IC6.8 | C6.2 47.6,52.05 48.16,52.61 IC1.18 48.16,57.05 49.13,58.02 IC1.28 55.65,58.02 55.88,57.78 55.88,57.15 | 55.91,57.12 C7.2 | SJ4.2 SJ3.2 SJ2.2 SJ1.2 SJ0.2 SJ5.2 | R4.2 R3.2 19.85,48.42 24.77,53.34 29.21,53.34 | C6.2 45.09,51.44 43.18,53.34 29.21,53.34 | 29.21,53.34 PIN_UPDI.1 | R25.2 47.62,49.53 47.6,49.55 C6.2
  pour Top: 0.5,74.5 0.5,14 67.5,14 67.5,5 99.5,5 99.5,74.5
A0  (via drill 0.3)
  Top 0.203: R13.2 83.21,43.03 83.21,43.12 83.35,43.18 | v78.23,51.83 73.88,56.19 63.03,56.19 56.98,62.23 v56.1,62.23 | v47.65,61.07 46.94,60.36 45.96,60.36 IC1.10
  Top 0.305: 83.35,43.18 CON_BR.2
  Bottom 0.203: v78.23,51.83 81.25,51.83 89.88,43.2 90.14,43.2 CON_BR.2 | v56.1,62.23 48.81,62.23 v47.65,61.07
A5  (via drill 0.3)
  Top 0.203: v35.38,54.05 37.78,56.45 45.87,56.45 IC1.15
  Top 0.406: PIN_ANA1.2 16.98,69.38 R24.2
  Bottom 0.203: v35.38,54.05 34.94,53.61 28.71,53.61 22.23,60.1 22.23,63.12 16.54,68.81 16.54,69.79 PIN_ANA1.2
A6  (via drill 0.3)
  Top 0.203: v46.49,54.85 45.96,55.38 45.96,55.56 IC1.16 | v56.27,51.83 v52.36,51.83
  Bottom 0.203: v46.49,54.85 49.34,54.85 v52.36,51.83 | v56.27,51.83 72.54,35.56 86.14,35.56 89.88,31.83 90.14,31.83 CON_IRDA.2
A7  (via drill 0.3)
  Top 0.203: R23.2 PIN_ANA2.2 | v52.36,61.07 51.47,61.07 47.3,56.9 47.3,54.23 IC1.17
  Bottom 0.203: v52.36,61.07 56.45,61.07 64.72,69.34 64.72,69.79 PIN_ANA2.2
A8  (via drill 0.3)
  Top 0.203: R22.2 PIN_ANA2.3 | v51.38,55.38 51.38,54.23 IC1.22
  Bottom 0.203: v51.38,55.38 51.38,57.96 53.25,59.83 56.45,59.83 64.28,67.65 65.61,67.65 67.3,69.34 67.3,69.79 PIN_ANA2.3
A9  (via drill 0.3)
  Top 0.203: R21.2 PIN_ANA2.4 | v57.7,55.56 54.94,52.81 52.45,52.81 52.18,53.07 52.18,54.14 IC1.23
  Bottom 0.203: v57.7,55.56 57.96,55.56 68.99,66.59 68.99,68.01 69.79,68.81 69.79,69.79 PIN_ANA2.4
A10  (via drill 0.3)
  Top 0.203: R20.2 PIN_ANA2.5 | v56.27,54.94 55.56,54.23 52.98,54.23 IC1.24
  Bottom 0.203: v56.27,54.94 57.87,54.94 71.39,68.45 71.48,68.45 72.36,69.34 72.36,69.79 PIN_ANA2.5
A11  (via drill 0.3)
  Top 0.203: PIN_ANA2.6 R19.2 | v55.12,54.85 54.41,55.56 IC1.25
  Bottom 0.203: v55.12,54.85 55.56,54.85 56.1,54.32 59.83,54.32 73.7,68.19 73.79,68.19 74.85,69.25 74.85,69.79 PIN_ANA2.6
AD0
  Top 0.203: IC2.1 36.45,30.94 36.45,39.12 35.74,39.83 35.74,42.94 36.09,43.29 36.72,43.29 R7.2
  Top 0.406: R7.2 SJ0.1
AD1
  Top 0.203: IC2.2 36.36,30.23 35.29,30.23 35.12,30.4 35.12,39.56 35.38,39.83 35.38,42.94 35.03,43.29 34.4,43.29 R8.2
  Top 0.406: R8.2 SJ1.1
AD2
  Top 0.203: IC2.3 36.36,29.6 35.65,29.6 35.56,29.69 35.38,29.69 35.29,29.6 34.76,30.14 34.76,38.23 32.8,40.18 32.8,43.03 32.54,43.29 31.91,43.29 R9.2
  Top 0.406: R9.2 SJ2.1
AD3
  Top 0.203: IC2.4 36.36,28.98 35.2,28.98 30.32,33.87 30.32,42.94 29.96,43.29 29.34,43.29 R10.2
  Top 0.406: R10.2 SJ3.1
AD4
  Top 0.203: IC2.5 36.36,28.27 35.29,28.27 27.74,35.83 27.74,42.85 27.38,43.2 26.76,43.2 R11.2
  Top 0.406: R11.2 SJ4.1
AD5  (via drill 0.3)
  Top 0.203: v41.07,28.71 41.52,28.27 42.23,28.27 IC2.24 | v40.36,42.94 40.09,43.2 39.47,43.2 R12.2
  Top 0.406: R12.2 SJ5.1
  Bottom 0.203: v41.07,28.71 41.07,42.23 v40.36,42.94
D1  (via drill 0.3)
  Top 0.203: v55.65,60.45 54.41,60.45 IC1.31
  Top 0.406: R14.2 PIN_DIGITAL.6
  Bottom 0.203: v55.65,60.45 45.61,60.45 36.89,69.16 36.89,69.79 PIN_DIGITAL.6
D8
  Top 0.203: IC1.6 48.98,62.67 48.98,63.74 45.16,67.56 43.92,67.56 40.72,70.76 40.72,71.21 39.92,72.01 35.92,72.01 34.4,70.5 34.4,69.96 PIN_DIGITAL.5
  Top 0.406: R15.2 PIN_DIGITAL.5
D9
  Top 0.203: IC1.7 48.18,62.67 48.18,63.74 47.92,64.01 38.67,64.01 37.25,62.59 33.87,62.59 32.8,63.65 32.8,66.5 32.54,66.76 31.91,66.76 R16.2
  Top 0.406: R16.2 PIN_DIGITAL.4
D10
  Top 0.203: IC1.8 47.3,62.67 37.87,62.67 37.43,62.23 31.74,62.23 30.32,63.65 30.32,66.5 29.96,66.85 29.34,66.85 R17.2
  Top 0.406: R17.2 PIN_DIGITAL.3
D11
  Top 0.203: IC1.9 45.87,61.25 30.14,61.25 27.74,63.65 27.74,66.5 27.38,66.85 26.85,66.85 R18.2
  Top 0.406: R18.2 PIN_DIGITAL.2
EXTCLK
  Top 0.203: R6.2 47.38,31.74 46.23,31.74 43.47,28.98 42.32,28.98 IC2.25
GND  (via drill 0.35)
  Top 0.406: v64.77,63.5 R23.1 | v67.31,63.5 R22.1 | v69.85,63.5 R21.1 | v72.39,63.5 R20.1 | v74.93,63.5 R19.1 | R18.1 v26.67,63.5 | R17.1 v29.21,63.5 | R16.1 v31.75,63.5 | R15.1 v34.29,63.5 | R14.1 v36.83,63.5 | SW1.3 73.1,45.01 v73.66,44.45 v78.74,44.45 78.74,45.85 SW1.4 | v72.39,57.15 72.72,57.48 LED2.3 | CON_BR.3 89.08,44.62 R13.1 81.75,44.62 80.01,46.35 | SW2.5 v21.59,53.34 | SW2.6 v21.59,55.88 | SW2.7 v21.59,58.42 | SW2.8 v21.59,60.96 | v81.92,1.91 81.92,2.54 83.5,4.13 | 83.5,4.13 81.92,5.71 v81.92,6.99 | v77.47,31.11 80.01,28.57 v82.55,31.11 85.69,34.25 CON_IRDA.3 | v66.67,29.84 71.12,29.84 IC5.2 | 68.58,33.02 v68.58,34.92 68.58,35.69 LED1.- | v73.66,34.92 73.66,33.02 | PIN_ANA1.3 18.58,69.38 R24.1 | IC1.19 48.97,52.9 48.97,51.65 | 48.97,51.52 48.97,51.65 | IC1.29 55.65,58.82 56.77,58.82 C7.1 v57.15,59.69 | IC4.9 v52.07,32.38 | IC3.9 v19.05,32.38 | v49.53,33.02 49.06,32.55 R6.1 | C11.1 v50.8,40.64 50.8,43.01 50.67,43.12 IC6.4 | v50.16,51.44 49.05,51.44 48.9,51.47 C6.1 48.98,51.65 48.97,51.65 | CON_VPWR.2 83.78,11.45 C1.1 | C8.1 v36.83,20.32 36.43,20.72 IC2.14 | C10.1 48.28,24.16 48.27,24.18 v48.26,24.13 | R5.1 v50.16,29.84 51.79,29.84 | 19.05,29.21 v16.51,26.67 C9.1 12.72,25.43 7.62,20.32 U1.3 | CON_VEXT.2 83.84,20.34 v81.28,17.78 79.53,17.78 C2.1 | v26.67,40.01 R11.1 | v29.21,40.01 R10.1 | v31.75,40.01 R9.1 | v34.29,40.01 R8.1 | v36.83,40.01 R7.1 | v39.37,40.01 R12.1 | 79.39,17.78 C2.1 | C2.1 79.39,17.96 79.39,19.56 78.23,20.71 78.23,24.8 80.01,26.58 C3.2 79.74,28.63 79.48,28.57 | C4.2 83.92,4.45 83.66,4.18 83.5,4.13
  Top 0.61: 79.48,28.57 73.66,28.57
  pour Bottom: 0.5,74.5 0.5,0.5 99.5,0.5 99.5,74.5
LED
  Top 0.203: LED2.4 73.79,54.32 64.36,54.32 57.07,61.61 55.92,61.61 55.38,62.14 53.87,62.14 53.34,61.61 53.34,60.01 53.7,59.65 54.32,59.65 IC1.30
LED0
  Top 0.203: IC2.6 36.36,27.65 35.65,27.65 35.56,27.74 35.38,27.74 35.2,27.56 31.83,27.56 29.25,30.14 IC3.1
LED1
  Top 0.203: IC2.7 36.36,27.03 29.78,27.03 27.91,28.89 27.91,30.05 IC3.2
LED2
  Top 0.203: IC3.3 26.67,28.89 29.25,26.31 36.36,26.31 IC2.8
LED3
  Top 0.203: IC2.9 36.36,25.69 35.65,25.69 35.56,25.78 35.38,25.78 35.2,25.6 28.8,25.6 25.51,28.89 25.51,29.96 25.43,30.05 IC3.4
LED4
  Top 0.203: IC2.10 36.36,25.07 27.91,25.07 24.09,28.89 24.09,30.05 IC3.5
LED5
  Top 0.203: IC2.11 36.36,24.36 27.38,24.36 22.85,28.89 22.85,30.05 IC3.6
LED6
  Top 0.203: IC2.12 36.36,23.74 35.65,23.74 35.56,23.82 35.38,23.82 35.2,23.65 26.94,23.65 21.69,28.89 21.69,29.96 21.6,30.05 IC3.7
LED7
  Top 0.203: IC2.13 36.36,23.11 26.05,23.11 20.27,28.89 20.27,30.05 IC3.8
LED8  (via drill 0.3)
  Top 0.203: v48.45,22.4 42.32,22.4 IC2.15 | v61.96,28.63 62.23,28.89 IC4.1
  Bottom 0.203: v48.45,22.4 55.74,22.4 v61.96,28.63
LED9  (via drill 0.3)
  Top 0.203: v48.01,23.11 42.32,23.11 IC2.16 | v60.72,28.63 60.98,28.89 60.98,30.05 IC4.2
  Bottom 0.203: v48.01,23.11 55.21,23.11 v60.72,28.63
LED10  (via drill 0.3)
  Top 0.203: v43.56,23.74 43.47,23.74 43.38,23.82 43.2,23.82 43.12,23.74 42.32,23.74 IC2.17 | v59.47,28.63 59.74,28.89 59.74,30.05 IC4.3
  Bottom 0.203: v43.56,23.74 46.94,23.74 51.21,28 58.85,28 v59.47,28.63
LED11  (via drill 0.3)
  Top 0.203: v46.85,24.45 42.32,24.45 IC2.18 | v58.05,28.63 58.32,28.89 58.32,29.96 58.41,30.05 IC4.4
  Bottom 0.203: v46.85,24.45 47.12,24.45 51.3,28.63 v58.05,28.63
LED12
  Top 0.203: IC2.19 42.32,25.07 48.72,25.07 49.25,25.6 53.87,25.6 57.16,28.89 57.16,30.05 IC4.5
LED13
  Top 0.203: IC2.20 43.12,25.69 43.2,25.78 43.38,25.78 43.56,25.6 48.72,25.6 49.16,26.05 53.07,26.05 55.92,28.89 55.92,30.05 IC4.6
LED14
  Top 0.203: IC2.21 42.32,26.4 52.01,26.4 54.5,28.89 54.5,29.96 54.59,30.05 IC4.7
LED15
  Top 0.203: IC4.8 53.34,28.89 51.47,27.03 42.32,27.03 IC2.22
LED_IN
  Top 0.406: LED1.+ R1.1
LEDOUT
  Top 0.203: LED2.2 78.59,57.52 78.59,62.32 85.08,68.81 85.08,69.79 PIN_LED.2
MISO
  Top 0.203: PIN_SPI.4 51.92,69.7 51.92,68.19 51.38,67.65 51.38,62.67 IC1.3
MOSI
  Top 0.203: IC1.2 52.18,62.67 52.18,66.41 54.59,68.81 54.59,69.79 PIN_SPI.5
OE
  Top 0.203: R5.2 47.38,29.87 45.7,29.87 43.38,27.56 43.2,27.56 43.03,27.74 42.41,27.74 IC2.23
OSC1
  Top 0.406: Y1.1 48.24,46.99 IC6.1
OSC2
  Top 0.406: Y1.2 48.24,45.72 IC6.2
OUT0
  Top 0.203: IC3.18 29.25,20.62 29.25,17.78 34.31,12.71 CON_LED1.1
OUT1
  Top 0.203: CON_LED1.3 28,16.45 28,20.62 IC3.17
OUT2
  Top 0.203: IC3.16 26.67,15.29 29.25,12.71 CON_LED1.5
OUT3
  Top 0.203: CON_LED1.7 26.67,12.89 25.43,14.13 25.43,20.62 IC3.15
OUT4
  Top 0.203: IC3.14 24.18,20.62 24.18,12.71 CON_LED1.9
OUT5
  Top 0.203: IC3.13 22.94,20.62 22.94,14.13 21.51,12.71 CON_LED1.11
OUT6
  Top 0.203: IC3.12 21.6,20.62 21.6,15.29 19.02,12.71 CON_LED1.13
OUT7
  Top 0.203: IC3.11 20.36,20.62 20.36,16.54 16.54,12.71 CON_LED1.15
OUT8
  Top 0.203: IC4.18 62.23,15.29 64.81,12.71 CON_LED2.1
OUT9
  Top 0.203: CON_LED2.3 62.23,12.89 60.98,14.13 60.98,20.62 IC4.17
OUT10
  Top 0.203: IC4.16 59.74,20.62 59.74,12.71 CON_LED2.5
OUT11
  Top 0.203: IC4.15 58.5,20.62 58.5,14.13 57.07,12.71 CON_LED2.7
OUT12
  Top 0.203: IC4.14 57.16,20.62 57.16,15.29 54.59,12.71 CON_LED2.9
OUT13
  Top 0.203: IC4.13 55.92,20.62 55.92,16.54 52.09,12.71 CON_LED2.11
OUT14
  Top 0.203: IC4.12 54.67,20.62 54.67,17.96 49.61,12.89 49.61,12.71 CON_LED2.13
OUT15
  Top 0.203: IC4.11 53.34,19.11 46.94,12.71 CON_LED2.15
RESET  (via drill 0.3)
  Top 0.203: 83.3,47.47 86.36,47.47 86.41,47.56 C5.2 | 83.3,47.47 R2.1 | 79.94,50.11 SW1.2 SW1.1 73.08,50.14 72.81,50.41 67.74,50.41 60.81,57.34 v58.94,57.34 | 83.3,47.47 R2.1 | v56.01,56.45 54.41,56.45 IC1.26
  Top 0.305: R2.1 82.58,47.46 79.94,50.11
  Bottom 0.203: v56.01,56.45 58.05,56.45 v58.94,57.34
RTS
  Top 0.203: PIN_FTDI.6 86.36,50.8 C5.1
RXD  (via drill 0.3)
  Top 0.203: v57.7,52.45 51.21,52.45 50.58,53.07 50.58,54.14 IC1.21
  Bottom 0.203: v57.7,52.45 77.52,52.45 81.34,56.27 85.79,56.27 86.59,57.07 87.57,57.07 PIN_FTDI.4
SCK
  Top 0.203: IC1.4 50.58,62.67 50.58,67.21 49.7,68.1 49.7,69.7 49.61,69.79 PIN_SPI.3
SCL  (via drill 0.3)
  Top 0.203: v48.01,33.78 47.74,33.78 43.56,29.6 43.47,29.6 43.38,29.69 43.2,29.69 43.12,29.6 IC2.26 | v54.76,44.09 55.03,44.36 55.92,44.36 56.01,44.45 IC6.6 | v52.98,58.76 52.98,62.59 IC1.1
  Top 0.406: PIN_I2C.2 JP2.3
  Bottom 0.203: 48.01,36.98 v48.01,33.78 | 48.01,36.98 54.76,43.74 v54.76,44.09 54.76,44.18 52.98,45.96 v52.98,58.76 | JP2.3 12.71,43.12 13.34,42.49 13.42,42.49 14.13,41.78 38.41,41.78 40.18,43.56 41.34,43.56 47.92,36.98 48.01,36.98
SCL_1
  Top 0.406: JP2.4 R4.1
SDA  (via drill 0.3)
  Top 0.203: IC1.32 54.41,61.25 56.9,61.25 58.32,59.83 58.32,44.36 57.07,43.12 56.1,43.12 IC6.5 56.01,43.12 55.74,43.12 55.56,42.94 55.56,38.41 51.56,34.4 47.83,34.4 43.83,30.4 43.74,30.4 43.56,30.23 43.47,30.23 43.38,30.32 42.32,30.32 IC2.27 42.23,30.23 42.14,30.14 41.6,30.14 41.34,30.4 41.16,30.23 v40.45,30.23
  Top 0.406: PIN_I2C.3 JP2.1
  Bottom 0.203: v40.45,30.23 23.65,30.23 11.29,42.58 11.29,44.27 12,44.98 12,45.07 12.62,45.7 JP2.1
SDA_1
  Top 0.406: JP2.2 R3.1
SQW
  Top 0.203: IC6.7 57.5,45.72 57.7,45.92 57.7,46.56 57.7,48.34 56.52,49.53 TP1.TP R25.1
SS
  Top 0.203: IC1.5 49.78,62.67 49.78,66.05 47.03,68.81 47.03,69.79 PIN_SPI.2
SW1
  Top 0.203: PIN_SWITCH.1 8.26,63.5 10.79,60.96 10.85,60.98 11.02,60.98 SW2.1 11.2,60.98 11.38,61.16 12.45,61.16 13.42,62.14 21.69,62.14 24.18,59.65 45.87,59.65 IC1.11
SW2
  Top 0.203: PIN_SWITCH.2 8.26,60.96 10.79,58.42 10.85,58.41 11.02,58.41 SW2.2 11.2,58.5 11.29,58.59 12.45,58.59 13.42,59.56 21.78,59.56 22.49,58.85 45.87,58.85 IC1.12
SW3
  Top 0.203: PIN_SWITCH.3 8.26,58.42 10.79,55.88 10.85,55.92 11.02,55.92 SW2.3 11.2,55.92 11.47,56.19 12.62,56.19 13.51,57.07 21.51,57.07 22.85,58.41 29.16,58.41 29.52,58.05 45.87,58.05 IC1.13
SW4
  Top 0.203: PIN_SWITCH.4 8.26,55.88 10.79,53.34 SW2.4 11.2,53.34 11.38,53.52 12.45,53.52 13.42,54.5 21.51,54.5 25.07,58.05 28.98,58.05 29.34,57.7 35.2,57.7 35.65,57.25 45.87,57.25 IC1.14
TXD  (via drill 0.3)
  Top 0.203: v57.7,51.21 51.65,51.21 49.78,53.07 49.78,54.14 IC1.20
  Bottom 0.203: v57.7,51.21 76.81,51.21 79.39,53.78 85.79,53.78 86.59,54.59 87.57,54.59 PIN_FTDI.5
UPDI  (via drill 0.3)
  Top 0.203: v49.25,57.16 54.32,57.16 IC1.27
  Bottom 0.203: v49.25,57.16 35.92,57.16 34.94,58.14 33.52,58.14 31.83,56.45 31.83,55.92 PIN_UPDI.2
VBAT
  Top 0.406: 48.26,43.18 49.53,44.45 IC6.3
  Top 0.61: U1.2 U1.1 19.68,35.56 22.86,38.73 22.86,48.26 26.04,51.44 41.91,51.44 44.45,48.9 44.45,43.81 45.09,43.18 48.26,43.18
VEXT
  Top 0.203: 89.64,8.71 89.7,8.71 89.7,8.89
  Top 0.406: JP1.1 78.74,6.35 81.28,8.89 89.53,8.89 89.7,8.89 95.25,8.89 97.79,11.43 97.79,20.32 95.27,22.84 CON_VEXT.1 | C4.1 89.64,8.71 89.64,8.78
VLED
  Top 0.406: C9.2 19.05,21.57 IC3.10 19.05,20.04 14.61,15.6 14.61,10.16 CON_LED1.16 | CON_LED2.16 43.18,10.16 43.18,12.7 50.16,19.68 52.01,19.68 52.09,19.82 52.09,20.54 IC4.10 52.07,22.86 49.55,22.86 49.52,22.85 C10.2
  pour Top: 13.97,10.79 13.97,0.5 80.64,0.5 80.64,3.94 66.67,3.94 66.67,10.79
VPWR
  Top 0.406: IC5.1 68.9,23.29 68.97,23.09 | 82.55,14.13 82.59,14.05 C1.2 82.68,13.96 82.68,13.95 | 73.66,13.34 73.7,13.42 73.66,13.72 | D1.1 69.25,17.87 69.34,17.87 69.61,17.78
  Top 0.61: CON_VPWR.1 82.77,13.95 82.68,13.95 | JP1.5 73.66,13.34 74.46,14.13 82.55,14.13 | 73.66,13.72 69.61,17.78 | D1.1 68.97,23.09

### Text on the board
tPlace: +5V | A5 | GND | +5V | D11 | D10 | D9 | D8 | D1 | GND | +5V | SS | SCK | MISO | MOSI | GND | +5V | A7 | A8 | A9 | A10 | A11 | GND | +5V | LED | GND | GND | SW1 | NC | SW2 | +5V | SW3 | RXD | SW4 | TXD | GND | +5V | UPDI | GND | RTS | GND | SDA | GND | SCL | A0 | +5V | +5V | ASURA7200 / (C)2021 BRIGHT-CHIPS | GND | A6 | +5V | VEXT | GND | LED15 | LED7 | LED0 | LED8 | VPWR | GND | VPWR | +5V | VEXT